# EAGLE design PIC16F628A-I (EAGLE 9.6.2)
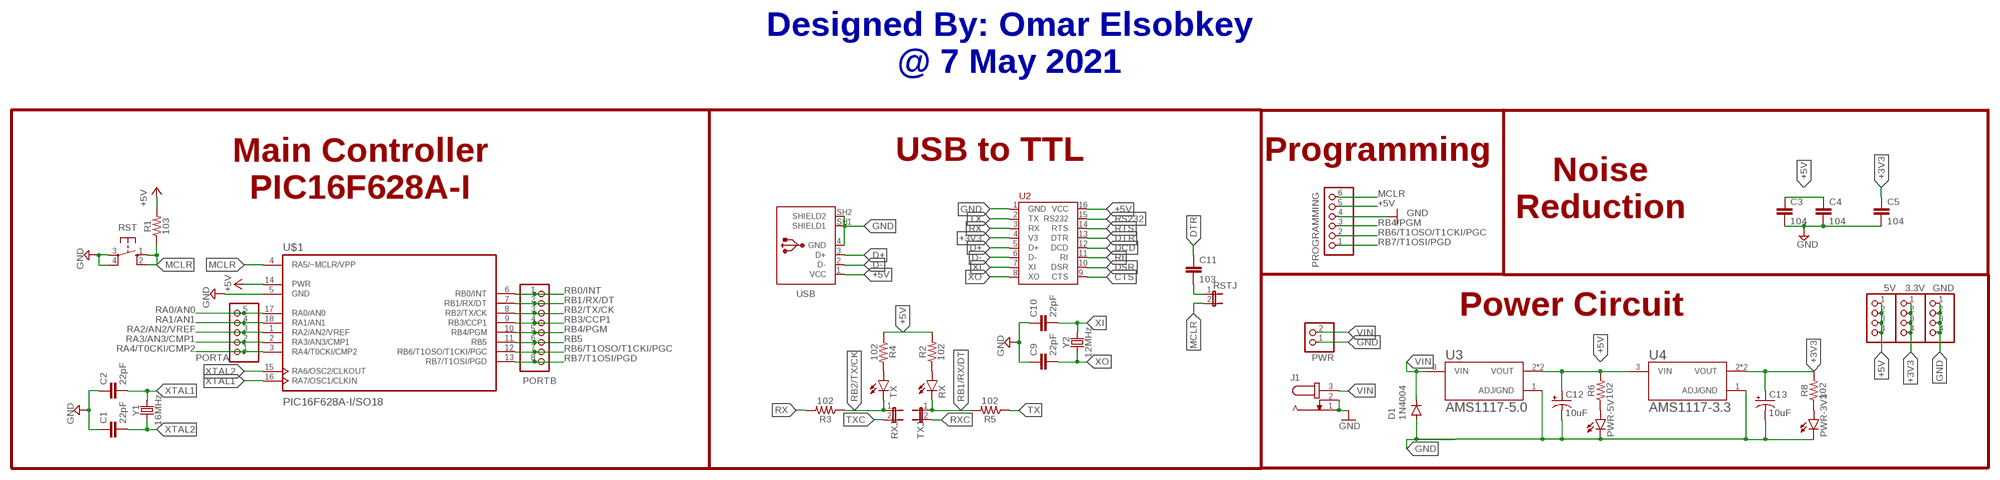
[diagram p0: schematic, sheet 1]

## Parts
3.3V  PINHD-1X4  [1X04]
5V  PINHD-1X4  [1X04]
C1  22pF  22PF-PTH-2.54MM-200V-5%  [CAP-PTH-2.54]
C2  22pF  22PF-PTH-2.54MM-200V-5%  [CAP-PTH-2.54]
C3  104  22PF-PTH-2.54MM-200V-5%  [CAP-PTH-2.54]
C4  104  22PF-PTH-2.54MM-200V-5%  [CAP-PTH-2.54]
C5  104  22PF-PTH-2.54MM-200V-5%  [CAP-PTH-2.54]
C9  22pF  22PF-PTH-2.54MM-200V-5%  [CAP-PTH-2.54]
C10  22pF  22PF-PTH-2.54MM-200V-5%  [CAP-PTH-2.54]
C11  103  22PF-PTH-2.54MM-200V-5%  [CAP-PTH-2.54]
C12  10uF  10UF-POLAR-RADIAL-2.5MM-KIT-25V-20%  [CPOL-RADIAL-2.5MM-5MM-KIT]
C13  10uF  10UF-POLAR-RADIAL-2.5MM-KIT-25V-20%  [CPOL-RADIAL-2.5MM-5MM-KIT]
D1  1N4004  [DO41-10]
GND  PINHD-1X4  [1X04]
J1  JACK-PLUG0  [SPC4077]
PORTA  PINHD-1X5  [1X05]
PORTB  PINHD-1X8  [1X08]
PROGRAMMING  PINHD-1X6  [1X06]
PWR  PINHD-1X2  [1X02]
PWR-3V3  LEDCHIP-LED0805  [CHIP-LED0805]
PWR-5V  LEDCHIP-LED0805  [CHIP-LED0805]
R1  103  RESISTOR1206  [1206]
R2  102  RESISTOR1206  [1206]
R3  102  RESISTOR1206  [1206]
R4  102  RESISTOR1206  [1206]
R5  102  RESISTOR1206  [1206]
R6  102  RESISTOR1206  [1206]
R8  102  RESISTOR1206  [1206]
RST  10-XX  [B3F-10XX]
RSTJ  JP1E  [JP1]
RX  LEDCHIP-LED0805  [CHIP-LED0805]
RXJ  JP1E  [JP1]
TX  LEDCHIP-LED0805  [CHIP-LED0805]
TXJ  JP1E  [JP1]
U2  CH340G  [SOP-16]
U3  AMS1117-5.0  [AMS1117-5.0]
U4  AMS1117-3.3  AMS1117-5.0  [AMS1117-5.0]
U$1  PIC16F628A-I/SO18  [SOIC127P1030X265-18N]
USB  61729-1011  [61729-1011BLF]
Y1  16MHz  CRYSTALPTH-HC49UV  [HC49U]
Y2  12MHz  CRYSTALPTH-HC49UV  [HC49U]

## Nets
+3V3: 3.3V.1 3.3V.2 3.3V.3 3.3V.4 C5.1 C13.1(+) R8.2 U2.4(V3) U4.2(VOUT) U4.4(VOUT)
+5V: 5V.1 5V.2 5V.3 5V.4 C3.1 C4.1 C12.1(+) PROGRAMMING.5 R1.2 R2.2 R4.1 R6.2 U2.16(VCC) U3.2(VOUT) U3.4(VOUT) U4.3(VIN) U$1.14(PWR) USB.1(VCC)
CTS: U2.9(CTS)
D+: U2.5(D+) USB.3(D+)
D-: U2.6(D-) USB.2(D-)
DCD: U2.12(DCD)
DSR: U2.10(DSR)
DTR: C11.1 U2.13(DTR)
GND: C1.1 C2.1 C3.2 C4.2 C5.2 C9.1 C10.1 C12.2(-) C13.2(-) D1.A GND.1 GND.2 GND.3 GND.4 J1.1 J1.2 PROGRAMMING.4 PWR-3V3.C PWR-5V.C PWR.1 RST.3(P) RST.4(P1) U2.1(GND) U3.1(ADJ/GND) U4.1(ADJ/GND) U$1.5(GND) USB.4(GND) USB.SH1(SHIELD1) USB.SH2(SHIELD2)
MCLR: PROGRAMMING.6 R1.1 RST.1(S) RST.2(S1) RSTJ.2 U$1.4(RA5/~MCLR/VPP)
N$1: R2.1 RX.A
N$2: R4.2 TX.A
N$3: PWR-5V.A R6.1
N$6: PWR-3V3.A R8.1
N$100: C11.2 RSTJ.1
RA0/AN0: PORTA.5 U$1.17(RA0/AN0)
RA1/AN1: PORTA.4 U$1.18(RA1/AN1)
RA2/AN2/VREF: PORTA.3 U$1.1(RA2/AN2/VREF)
RA3/AN3/CMP1: PORTA.2 U$1.2(RA3/AN3/CMP1)
RA4/T0CKI/CMP2: PORTA.1 U$1.3(RA4/T0CKI/CMP2)
RB0/INT: PORTB.1 U$1.6(RB0/INT)
RB1/RX/DT: PORTB.2 R5.2 RX.C TXJ.1 U$1.7(RB1/RX/DT)
RB2/TX/CK: PORTB.3 R3.1 RXJ.1 TX.C U$1.8(RB2/TX/CK)
RB3/CCP1: PORTB.4 U$1.9(RB3/CCP1)
RB4/PGM: PORTB.5 PROGRAMMING.3 U$1.10(RB4/PGM)
RB5: PORTB.6 U$1.11(RB5)
RB6/T1OSO/T1CKI/PGC: PORTB.7 PROGRAMMING.2 U$1.12(RB6/T1OSO/T1CKI/PGC)
RB7/T1OSI/PGD: PORTB.8 PROGRAMMING.1 U$1.13(RB7/T1OSI/PGD)
RI: U2.11(RI)
RS232: U2.15(RS232)
RTS: U2.14(RTS)
RX: R3.2 U2.3(RX)
RXC: TXJ.2
TX: R5.1 U2.2(TX)
TXC: RXJ.2
VIN: D1.C J1.3 PWR.2 U3.3(VIN)
XI: C10.2 U2.7(XI) Y2.2
XO: C9.2 U2.8(XO) Y2.1
XTAL1: C2.2 U$1.16(RA7/OSC1/CLKIN) Y1.2
XTAL2: C1.2 U$1.15(RA6/OSC2/CLKOUT) Y1.1

## Notes on the sheet
- Designed By: Omar Elsobkey
  @ 7 May 2021
- USB to TTL | Programming
- Main Controller
  PIC16F628A-I
- Noise
  Reduction
- Power Circuit

## Library data of the parts
3.3V 5V GND = pinhead:PINHD-1X4: PIN HEADER
C1 C2 C9 C10 = SparkFun-Capacitors:22PF: 22pF ceramic capacitors A capacitor is a passive two-terminal electrical component used to store electrical energy temporarily in an electric field.; PROD_ID: CAP-09128
C3-C5 C11 = SparkFun-Capacitors:22PF: 22pF ceramic capacitors A capacitor is a passive two-terminal electrical component used to store electrical energy temporarily in an electric field.; PROD_ID: CAP-09128; VALUE: 22pF
C12 C13 = SparkFun-Capacitors:10UF-POLAR: 10.0µF polarized capacitors A capacitor is a passive two-terminal electrical component used to store electrical energy temporarily in an electric field.; PROD_ID: CAP-08440
D1 = diode:1N4004: DIODE general purpose rectifier, 1 A
J1 = con-jack:JACK-PLUG: DC POWER JACK Power Jack, DC, Right Angle, Through Hole, Rated 5A at 16VDC, PC Terminals Distributor: Farnell (www.Farnell.de) Drawing: 84N1161.pdf / 84N1162.pdf Manufacturer: SPC Technology (www.spctechnology.com) Type: SPC4077 / SPC 4078; OC_FARNELL: unknown; OC_NEWARK: unknown
PORTA = pinhead:PINHD-1X5: PIN HEADER
PORTB = pinhead:PINHD-1X8: PIN HEADER
PROGRAMMING = pinhead:PINHD-1X6: PIN HEADER
PWR = pinhead:PINHD-1X2: PIN HEADER
PWR-3V3 PWR-5V RX TX = led:LED: LED OSRAM: - CHIPLED LG R971, LG N971, LY N971, LG Q971, LY Q971, LO R971, LY R971 LH N974, LH R974 LS Q976, LO Q976, LY Q976 LO Q996 - Hyper CHIPLED LW Q18S LB Q993, LB Q99A, LB R99A - SideLED LS A670, LO A670, LY A670, LG A670, LP A670 LB A673, LV A673, LT A673, LW A673 LH A674 LY A675 LS A676, LA A676, LO A676, LY A676, LW A676 LS A679, LY A679, LG A679 - Hyper Micro SIDELED® LS Y876, LA Y876, LO Y876, LY Y876 LT Y87S - SmartLED LW L88C, LW L88S LB L89C, LB L89S, LG L890 LS L89K, LO L89K, LY L89K LS L896, LA L896, LO L896, LY L896 - TOPLED LS T670, LO T670, LY T670, LG T670, LP T670 LSG T670, LSP T670, LSY T670, LOP T670, LYG T670 LG T671, LOG T671, LSG T671 LB T673, LV T673, LT T673, LW T673 LH T674 LS T676, LA T676, LO T676, LY T676, LB T676, LH T676, LSB T676, LW T676 LB T67C, LV T67C, LT T67C, LS T67K, LO T67K, LY T67K, LW E67C LS E67B, LA E67B, LO E67B, LY E67B, LB E67C, LV E67C, LT E67C LW T67C LS T679, LY T679, LG T679 LS T770, LO T770, LY T770, LG T770, LP T770 LB T773, LV T773, LT T773, LW T773 LH T774 LS E675, LA E675, LY E675, LS T675 LS T776, LA T776, LO T776, LY T776, LB T776 LHGB T686 LT T68C, LB T68C - Hyper Mini TOPLED® LB M676 - Mini TOPLED Santana® LG M470 LS M47K, LO M47K, LY M47K Source: http://www.osram.convergy.de LUXEON: - LUMILED® LXK2-PW12-R00, LXK2-PW12-S00, LXK2-PW14-U00, LXK2-PW14-V00 LXK2-PM12-R00, LXK2-PM12-S00, LXK2-PM14-U00 LXK2-PE12-Q00, LXK2-PE12-R00, LXK2-PE12-S00, LXK2-PE14-T00, LXK2-PE14-U00 LXK2-PB12-K00, LXK2-PB12-L00, LXK2-PB12-M00, LXK2-PB14-N00, LXK2-PB14-P00, LXK2-PB14-Q00 LXK2-PR12-L00, LXK2-PR12-M00, LXK2-PR14-Q00, LXK2-PR14-R00 LXK2-PD12-Q00, LXK2-PD12-R00, LXK2-PD12-S00 LXK2-PH12-R00, LXK2-PH12-S00 LXK2-PL12-P00, LXK2-PL12-Q00, LXK2-PL12-R00 Source: www.luxeon.com KINGBRIGHT: KA-3528ASYC Source: www.kingbright.com
R1-R6 R8 = SparkFun-Resistors:RESISTOR: Generic Resistor Package
RST = switch-omron:10-XX: OMRON SWITCH; MPN: B3F-1000; OC_FARNELL: 176432; OC_NEWARK: 36M3542
RSTJ RXJ TXJ = jumper:JP1E: JUMPER
U2 = CH340G:CH340G
U3 U4 = AMS1117-5.0:AMS1117-5.0: Sot223/Pkg 1-Amp 5-Volt Low Drop Out Voltage Regulatator; AVAILABILITY: Unavailable; DESCRIPTION: Sot223/Pkg 1-Amp 5-Volt Low Drop Out Voltage Regulatator; MF: Advanced Monolithic Systems; MP: AMS1117-5.0; PACKAGE: None; PRICE: None
U$1 = PIC16F628A-I_SO:PIC16F628A-I/SO18: Check prices <https://pricing.snapeda.com/parts/PIC16F628A-I/SO/Microchip%20Technology/view-part?ref=eda>; AVAILABILITY: Good; DESCRIPTION: PIC PIC® 16F Microcontroller IC 8-Bit 20MHz 3.5KB (2K x 14) FLASH 18-SOIC; MF: Microchip Technology; MP: PIC16F628A-I/SO; PACKAGE: SOIC-18 Microchip; PRICE: None; PURCHASE-URL: https://pricing.snapeda.com/search/part/PIC16F628A-I/SO/?ref=eda
USB = Connector_USB:61729-1011: USB(2.0) Type-B, RCPT, 4POS, THT-R/A Datasheet <https://www.amphenol-icc.com/media/wysiwyg/files/drawing/61729.pdf>; CATEGORY: Connector; CONTACTS: 4; CURRENT_RATING: 1A; DESCRIPTION: CONN RCPT USB2.0 TYPEB 4POS R/A; GENDER: Receptacle; MANUFACTURER: Amphenol ICC (FCI); MOUNT_TYPE: R/A; MPN: 61729-1011BLF; OPERATING_TEMP: -55°C to 85°C; PART_STATUS: Active; ROHS_COMPLIANT: RoHS Compliant; SERIES: 61729; SUB-CATEGORY: USB; TYPE: USB-B
Y1 Y2 = SparkFun-Clocks:CRYSTAL: Crystals (Generic) These are passive quartz crystals, which can be used as a clock source for a microcontroller. Crystal's are two-terminal devices. They require external "load" capacitors to generate an oscillating signal.

## Board
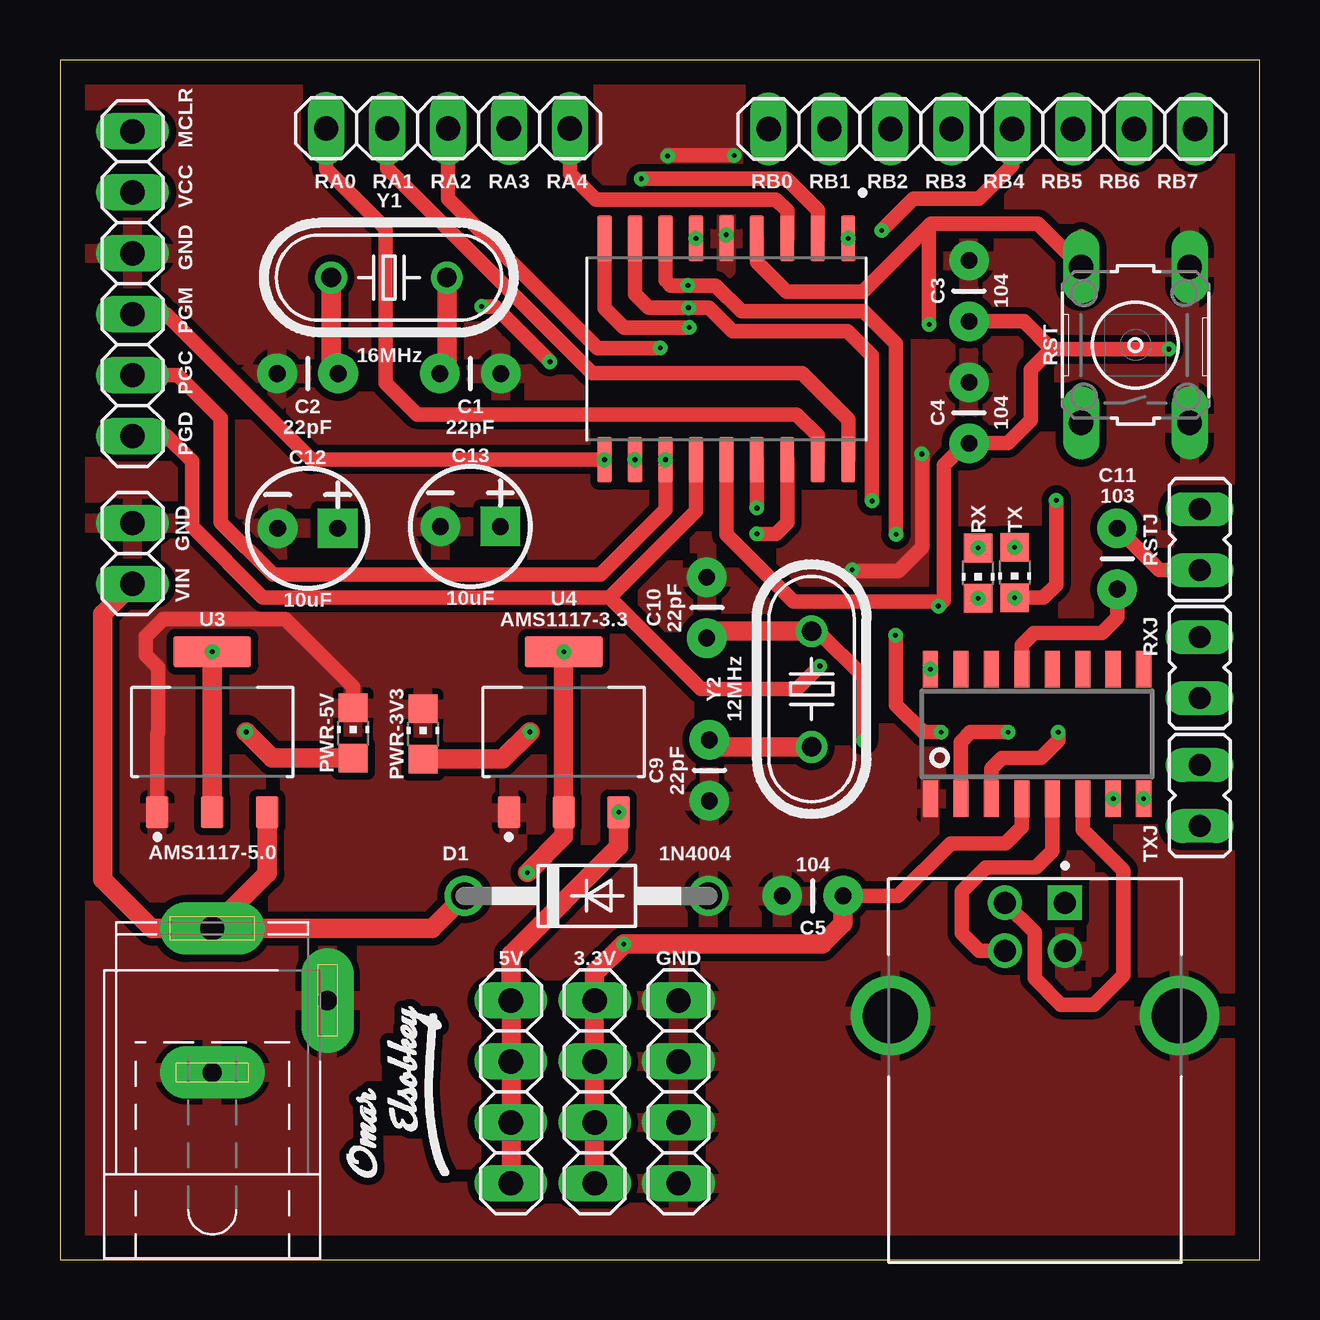
[diagram p1: board, top side]
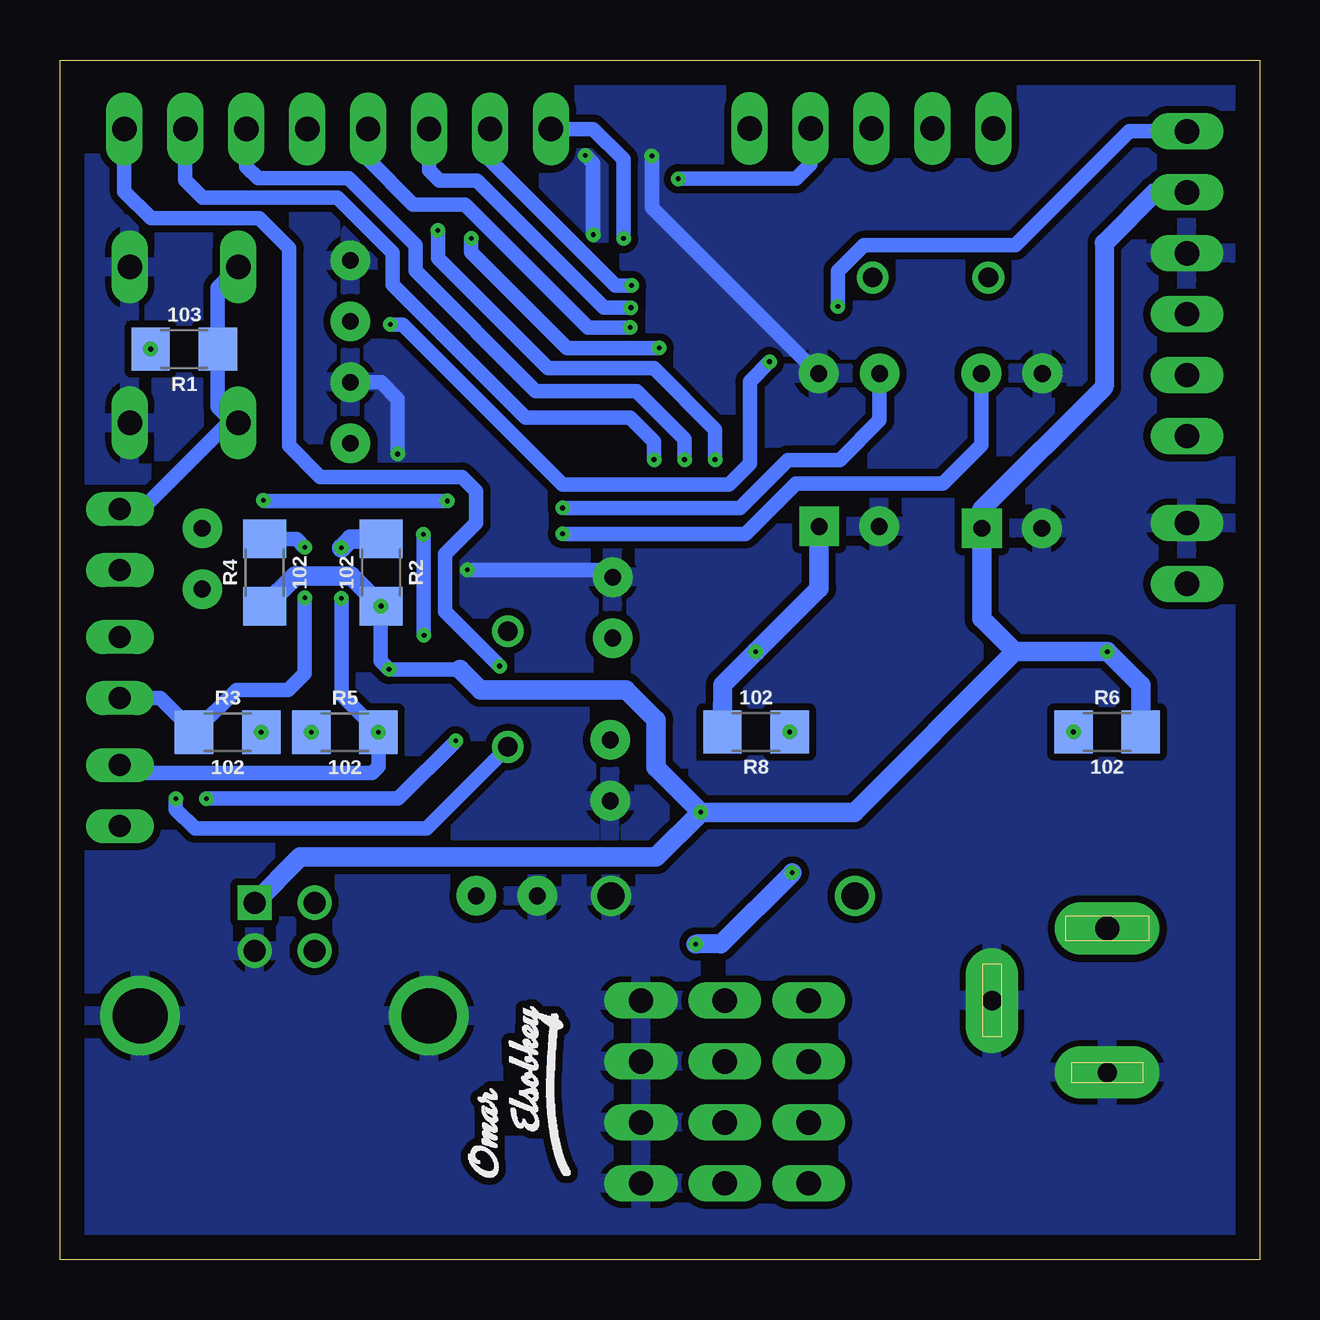
[diagram p2: board, bottom side, seen from below]

Size 50 x 50 mm. Coordinates in mm from the lower left corner, seen from the top.
Outline: 0,0 50,0 50,50 0,50 0,0
Copper layers (1*16): Top 0.035mm / dielectric 1.5mm / Bottom 0.035mm
Design rules "default *": minimum track width 0.3mm, minimum drill 0.2mm, track to track 0.2mm, track to pad 0.2mm, pad to pad 0.2mm, via to via 0.2mm, smd to smd 0.2mm, copper to edge 40mil, drill to drill 6mil, minimum pad ring 10mil, minimum via ring 8mil, stop-mask expansion 4mil, vias tented up to drill 0mil, thermal gap 10mil

### Footprints (pad centres in the part's own frame; a part is rotated, then mirrored left to right if it is on the bottom)
1X04 = drill 1.016 long: 1 -3.81,0; 2 -1.27,0; 3 1.27,0; 4 3.81,0
CAP-PTH-2.54 = drill 0.7 pad 1.651: 1 -1.27,0; 2 1.27,0
CPOL-RADIAL-2.5MM-5MM-KIT = drill 0.7 pad 1.651 square: 1 1.25,0 | drill 0.7 pad 1.651: 2 -1.25,0
DO41-10 = drill 1.118: A 5.08,0; C -5.08,0
SPC4077 = drill 0.8 pad 2.184 long: 1 -3,0; 2 0,-4.8 | drill 1 pad 2.184 long: 3 3,0
1X05 = drill 1.016 long: 1 -5.08,0; 2 -2.54,0; 3 0,0; 4 2.54,0; 5 5.08,0
1X08 = drill 1.016 long: 1 -8.89,0; 2 -6.35,0; 3 -3.81,0; 4 -1.27,0; 5 1.27,0; 6 3.81,0; 7 6.35,0; 8 8.89,0
1X06 = drill 1.016 long: 1 -6.35,0; 2 -3.81,0; 3 -1.27,0; 4 1.27,0; 5 3.81,0; 6 6.35,0
1X02 = drill 1.016 long: 1 -1.27,0; 2 1.27,0
CHIP-LED0805 = smd 1.2 x 1.2: A 0,-1.05; C 0,1.05
1206 = smd 1.6 x 1.8: 1 -1.4,0; 2 1.4,0
B3F-10XX = drill 1.016 long: 1 -3.251,2.261; 2 3.251,2.261; 3 -3.251,-2.261; 4 3.251,-2.261
JP1 = drill 0.914 long: 1 0,-1.27; 2 0,1.27
SOP-16 = smd 0.635 x 1.524: 1 -4.445,-2.695; 2 -3.175,-2.695; 3 -1.905,-2.695; 4 -0.635,-2.695; 5 0.635,-2.695; 6 1.905,-2.695; 7 3.175,-2.695; 8 4.445,-2.695; 9 4.445,2.695; 10 3.175,2.695; 11 1.905,2.695; 12 0.635,2.695; 13 -0.635,2.695; 14 -1.905,2.695; 15 -3.175,2.695; 16 -4.445,2.695
AMS1117-5.0 = smd 0.93 x 1.31: 1 -2.29,-3.345; 2 0,-3.345; 3 2.29,-3.345 | smd 3.24 x 1.31: 4 0,3.345
SOIC127P1030X265-18N = smd 1.91 x 0.6: 1 -4.61,5.08; 2 -4.61,3.81; 3 -4.61,2.54; 4 -4.61,1.27; 5 -4.61,0; 6 -4.61,-1.27; 7 -4.61,-2.54; 8 -4.61,-3.81; 9 -4.61,-5.08; 10 4.61,-5.08; 11 4.61,-3.81; 12 4.61,-2.54; 13 4.61,-1.27; 14 4.61,0; 15 4.61,1.27; 16 4.61,2.54; 17 4.61,3.81; 18 4.61,5.08
61729-1011BLF = drill 0.92 square: 1 1.25,4.71 | drill 0.92: 2 -1.25,4.71; 3 -1.25,2.71; 4 1.25,2.71 | drill 2.3: SH1 -6.02,0; SH2 6.02,0
HC49U = drill 0.813: 1 -2.413,0; 2 2.413,0

### Placement (x,y rotation side)
3.3V  22.29,6.99 90 top
5V  18.8,6.99 90 top
C1  17.11,36.93 180 top
C2  10.32,36.93 0 top
C3  37.9,40.38 90 top
C4  37.9,35.3 90 top
C5  31.38,15.16 180 top
C9  27.07,20.39 90 top
C10  26.96,27.17 270 top
C11  44.07,29.21 90 top
C12  10.32,30.48 0 top
C13  17.11,30.55 0 top
D1  21.95,15.16 0 top
GND  25.78,6.99 90 top
J1  6.35,10.79 90 top
PORTA  16.18,47.15 180 top
PORTB  38.42,47.12 0 top
PROGRAMMING  3.02,40.67 90 top
PWR  3.02,29.43 270 top
PWR-3V3  15.13,21.91 0 top
PWR-5V  12.22,21.95 0 top
R1  44.82,37.95 180 bottom
R2  36.62,28.64 270 bottom
R3  43.01,21.98 0 bottom
R4  41.47,28.64 90 bottom
R5  38.12,21.98 0 bottom
R6  6.36,22 0 bottom
R8  20.98,22 180 bottom
RST  44.83,38.12 90 top
RSTJ  47.5,30 0 top
RX  38.27,28.61 180 top
RXJ  47.5,24.67 0 top
TX  39.8,28.64 180 top
TXJ  47.5,19.34 180 top
U2  40.73,21.91 0 top
U3  6.35,21.99 0 top
U4  21,21.99 0 top
U$1  27.77,37.95 270 top
U$2  [OMAR_ELSOBKEY_X0.5_TN]  14.28,6.64 90 top
U$3  [OMAR_ELSOBKEY_X0.5_TN]  30.66,6.64 90 bottom
U$4  [OMAR_ELSOBKEY_X0.5_T]  30.66,6.64 90 bottom
U$5  [OMAR_ELSOBKEY_X0.5_T]  14.28,6.64 90 top
USB  40.64,10.16 0 top
Y1  13.71,40.93 180 top
Y2  31.33,23.78 90 top

### Tracks (layer width: path | path; a pad name or v marks a point on that pad's centre or on a via)
+3V3  (via drill 0.2, 0.2 pad 0.3)
  Top 0.61: U2.4 40.09,18.04 39.4,17.35 37.12,17.35 34.94,15.16 C5.1
  Top 0.8: 3.3V.1 3.3V.2 3.3V.3 3.3V.4 | U4.2 21,17.65 v19.48,16.12
  Top 0.813: 3.3V.4 22.29,11.94 v23.5,13.15 31.77,13.15 32.65,14.02 C5.1 | U4.4 U4.2
  Bottom 0.8: v19.48,16.12 22.45,13.15 v23.5,13.15 | U4.4 22.39,23.95 22.39,23.15
  Bottom 0.813: 22.39,23.15 R8.2 | U4.4 18.36,27.98 C13.1
  other vias: 21,25.33
+5V  (via drill 0.2, 0.2 pad 0.3)
  Top 0.61: U$1.14 27.77,30.23 30.56,27.44 36.42,27.44 R2.2 36.85,27.47 36.85,33.12 37.67,33.95 37.82,33.95 C4.1 39.5,34.02 40.48,35 40.48,37.1 41.33,37.95 | C3.1 40.17,39.1 41.33,37.95 | 41.33,37.95 R1.2
  Top 0.8: 5V.4 5V.3 5V.2 5V.1
  Top 0.813: U3.4 U3.2 | 5V.4 18.8,12.72 23.29,17.21 U4.3
  Bottom 0.61: 33.33,24.6 U2.16 36.63,24.95 36.63,27.23 R2.2 | U4.3 | C4.1 37.82,33.95
  Bottom 0.8: PROGRAMMING.5 4.37,44.48 6.47,42.38 6.47,36.38 11.57,31.28 C12.1
  Bottom 0.813: R6.2 4.96,23.94 U3.4 10.19,25.33 | 10.19,25.33 16.88,18.64 U4.3 25.15,20.5 25.15,22.5 26.4,23.75 32.48,23.75 33.33,24.6 | 10.19,25.33 11.57,26.72 C12.1 | 36.67,27.24 R2.2 37.88,28.5 40.2,28.5 R4.1 | USB.1 39.98,16.77 25.15,16.77 U4.3
  other vias: 6.35,25.33 23.29,18.64 36.28,24.6 36.62,27.24 46.22,37.95
D+
  Top 0.61: U2.5 41.36,17.04 40.67,16.35 38.6,16.35 37.6,15.35 37.6,13.6 38.33,12.87 USB.3
D-
  Top 0.61: U2.6 42.63,17.91 44.33,16.21 44.33,11.85 43.1,10.62 41.73,10.62 40.62,11.72 40.62,13.63 USB.2
DTR
  Top 0.61: C11.1 44.07,26.77 43.42,26.12 40.6,26.12 40.09,25.61 U2.13
GND  (via drill 0.2 pad 0.3)
  Top 0.61: v27.77,42.71 U$1.5 | v28.1,46.02 25.35,46.02 v25.32,46 | U3.1 4.06,21.91 4.1,21.95 4.1,24.68 3.58,25.2 3.58,25.98 4.3,26.7 9.38,26.7 12.22,23.86 PWR-5V.C | v35.92,33.58 35.94,33.56 35.94,29.69 34.95,28.7 33.08,28.7 v33.02,28.75
  Bottom 0.61: v27.77,42.71 27.77,45.7 v28.1,46.02 | v25.32,46 25.32,43.85 18.41,36.93 C1.1 | C4.2 36.62,36.56 35.92,35.88 v35.92,33.58 | C10.1 27.27,28.75 v33.02,28.75
  pour Bottom (isolate 0.3): -2.62,51.4 51.48,51.4 51.48,-1.38 -2.62,-1.38
  pour Top (isolate 0.3): -1.8,51.23 52.3,51.23 52.3,-1.55 -1.8,-1.55
MCLR  (via drill 0.2 pad 0.3)
  Top 0.61: U$1.4 29.05,41.58 30.29,40.34 33.46,40.34 36.23,43.1 | 42.57,42.66 RST.2 40.77,43.17 36.3,43.17 36.23,43.1 | 42.57,34.49 RST.1 | v17.57,39.73 18.12,39.73 v20.43,37.42 | v36.23,38.98 36.23,43.1
  Bottom 0.61: 42.66,34.77 RST.1 | 42.66,34.77 43.42,35.53 R1.1 43.42,40.52 RST.2 | RSTJ.2 46.58,31.27 43.08,34.77 42.66,34.77 | PROGRAMMING.6 5.42,47.02 10.18,42.27 16.5,42.27 17.57,41.2 v17.57,39.73 | v20.43,37.42 21.25,36.6 21.25,33.17 22.12,32.3 29.05,32.3 35.73,38.98 v36.23,38.98
N$1  (via drill 0.2)
  Bottom 0.813: R2.1 37.9,30.04 RX.A
  other vias: 38.27,29.66
N$2  (via drill 0.2)
  Bottom 0.61: R4.2 40.15,30.04 TX.A
  other vias: 39.8,29.69
N$3  (via drill 0.2)
  Top 0.813: PWR-5V.A 8.85,20.9 v7.75,22
N$6  (via drill 0.2)
  Top 0.813: PWR-3V3.A 18.45,20.86 R8.1
  other vias: 19.59,22
N$100
  Top 0.61: C11.2 45.82,28.73 RSTJ.1
RA0/AN0
  Top 0.61: PORTA.5 11.1,45.45 13.57,42.98 13.57,36.52 14.88,35.23 30.7,35.23 31.59,34.34 U$1.17
RA1/AN1
  Top 0.61: U$1.18 32.85,35.02 30.93,36.95 22.18,36.95 13.63,45.49 PORTA.4
RA2/AN2/VREF  (via drill 0.2 pad 0.3)
  Top 0.61: v25.02,38 22.4,38 16.18,44.23 PORTA.3
  Bottom 0.61: U$1.1 32.85,41.98 28.87,38 v25.02,38
  other vias: 32.85,42.56
RA3/AN3/CMP1  (via drill 0.2 pad 0.3)
  Top 0.61: U$1.2 31.59,43.74 30.27,45.05 v24.23,45.05
  Bottom 0.61: PORTA.2 18.71,45.66 19.32,45.05 v24.23,45.05
RA4/T0CKI/CMP2
  Top 0.61: U$1.3 30.32,43.71 29.85,44.17 22.35,44.17 21.25,45.27 PORTA.1
RB0/INT  (via drill 0.2 pad 0.3)
  Bottom 0.61: U$1.6 26.5,45.85 27.77,47.12 PORTB.1
  other vias: 26.5,42.56
RB1/RX/DT  (via drill 0.2 pad 0.3)
  Top 0.61: U$1.7 25.23,40.81 25.45,40.6 v26.18,40.6 27.33,40.6 28.4,39.53 33.5,39.53 34.85,38.17 v34.85,30.23 | R5.2 35.99,21.98 34.85,23.12 34.85,26 v34.83,26.02
  Bottom 0.61: RX.C 38.27,23.52 R5.2 36.73,20.55 37,20.27 47.17,20.27 TXJ.1 | v26.18,40.6 26.85,40.6 32.08,45.83 PORTB.2 | v34.85,30.23 34.85,26.05 v34.83,26.02
  other vias: 38.27,27.56 36.73,21.98
RB2/TX/CK  (via drill 0.2 pad 0.3)
  Top 0.61: U$1.8 23.96,40.23 24.52,39.67 v26.2,39.67 27.05,39.67 28.02,38.7 32.83,38.7 33.85,37.67 v33.85,31.62 | v41.52,31.65 41.52,28.12 40.99,27.59 TX.C
  Bottom 0.61: RXJ.1 45.83,23.4 R3.1 42.65,23.75 40.48,23.75 39.8,24.43 TX.C | v26.2,39.67 27.32,39.67 32.62,44.98 34.17,44.98 34.62,45.41 PORTB.3 | v33.85,31.62 41.49,31.62 v41.52,31.65
  other vias: 39.8,27.59
RB3/CCP1  (via drill 0.2 pad 0.3)
  Top 0.61: U$1.9 22.7,39.66 23.5,38.85 v26.23,38.85
  Bottom 0.61: v26.23,38.85 28,38.85 33.12,43.98 35.27,43.98 37.16,45.85 PORTB.4
RB4/PGM  (via drill 0.2 pad 0.3)
  Top 0.61: v34.25,42.9 35.58,44.23 38.3,44.23 39.7,45.62 PORTB.5 | U$1.10 10.48,33.34 4.42,39.41 PROGRAMMING.3
  Bottom 0.61: U$1.10 22.7,34.59 25.25,37.15 29.65,37.15 34.25,41.75 v34.25,42.9
  other vias: 22.7,33.34
RB5  (via drill 0.2 pad 0.3)
  Bottom 0.61: U$1.11 23.96,34.19 25.98,36.2 30.18,36.2 35.19,41.21 35.19,42.29 37.97,45.07 41.74,45.07 42.23,45.56 PORTB.6
  other vias: 23.96,33.34
RB6/T1OSO/T1CKI/PGC  (via drill 0.2 pad 0.3)
  Top 0.61: U$1.12 25.23,31.26 22.52,28.55 8.88,28.55 6.7,30.73 6.7,35.08 4.91,36.87 PROGRAMMING.2
  Bottom 0.61: U$1.12 25.23,34.09 26.25,35.1 30.6,35.1 36.14,40.64 36.14,41.96 38.44,44.26 44.05,44.26 44.77,44.98 PORTB.7
  other vias: 25.23,33.34
RB7/T1OSI/PGD  (via drill 0.2 pad 0.3)
  Top 0.61: PROGRAMMING.1 4.45,34.33 5.5,33.27 5.5,30.55 8.45,27.6 22.9,27.6 | U$1.13 26.5,31.2 22.9,27.6 | 22.9,27.6 26.73,23.77 30.71,23.77 v31.68,24.73
  Bottom 0.61: PORTB.8 47.31,44.52 46.2,43.4 41.69,43.4 40.45,42.15 40.45,33.92 39.15,32.62 33.25,32.62 32.65,32.02 32.65,30.7 33.95,29.4 33.95,27.01 v31.68,24.73
RX  (via drill 0.2)
  Top 0.61: U2.3 38.82,20.47 39.25,20.9 40.88,20.9 41.61,21.64 R3.2
  other vias: 41.61,21.98
TX  (via drill 0.2)
  Top 0.61: U2.2 37.55,21.57 37.95,21.98 R5.1
  other vias: 39.52,21.98
VIN
  Top 0.813: J1.3 8.64,16.09 U3.3 | J1.3 3.83,13.79 1.77,15.85 1.77,26.91 PWR.2 | J1.3 15.51,13.79 D1.C
XI  (via drill 0.2 pad 0.3)
  Top 0.61: Y2.2 31.58,26.19 33.5,24.27 v33.5,21.62
  Top 0.813: Y2.2 27.25,26.19 C10.2
  Bottom 0.61: v33.5,21.62 35.91,19.21 U2.7
  other vias: 43.9,19.21
XO  (via drill 0.2 pad 0.3)
  Top 0.813: C9.2 27.36,21.37 Y2.1
  Bottom 0.61: Y2.1 34.72,17.98 44.38,17.98 45.17,18.77 U2.8
  other vias: 45.17,19.21
XTAL1  (via drill 0.2 pad 0.3)
  Top 0.61: v29.05,30.25 29.85,30.25 30.32,30.71 U$1.16
  Top 0.813: Y1.2 11.3,37.22 C2.2
  Bottom 0.61: C2.2 11.59,33.96 13.2,32.35 19.32,32.35 21.43,30.25 v29.05,30.25
XTAL2  (via drill 0.2 pad 0.3)
  Top 0.61: v29.05,31.32 v29.05,31.33 U$1.15
  Top 0.813: C1.2 16.13,37.22 Y1.1
  Bottom 0.61: C1.2 15.84,34.99 17.5,33.33 19.65,33.33 21.65,31.32 v29.05,31.32

### Text on the board
tNames: RA0 RA1 RA2 RA3 RA4 | RB0 RB1 RB2 RB3 RB4 RB5 RB6 RB7 | PGD PGC PGM GND VCC MCLR | VIN GND